# EAGLE board PT_2015_PB_MAIN_Rev2 (EAGLE 7.2.0)
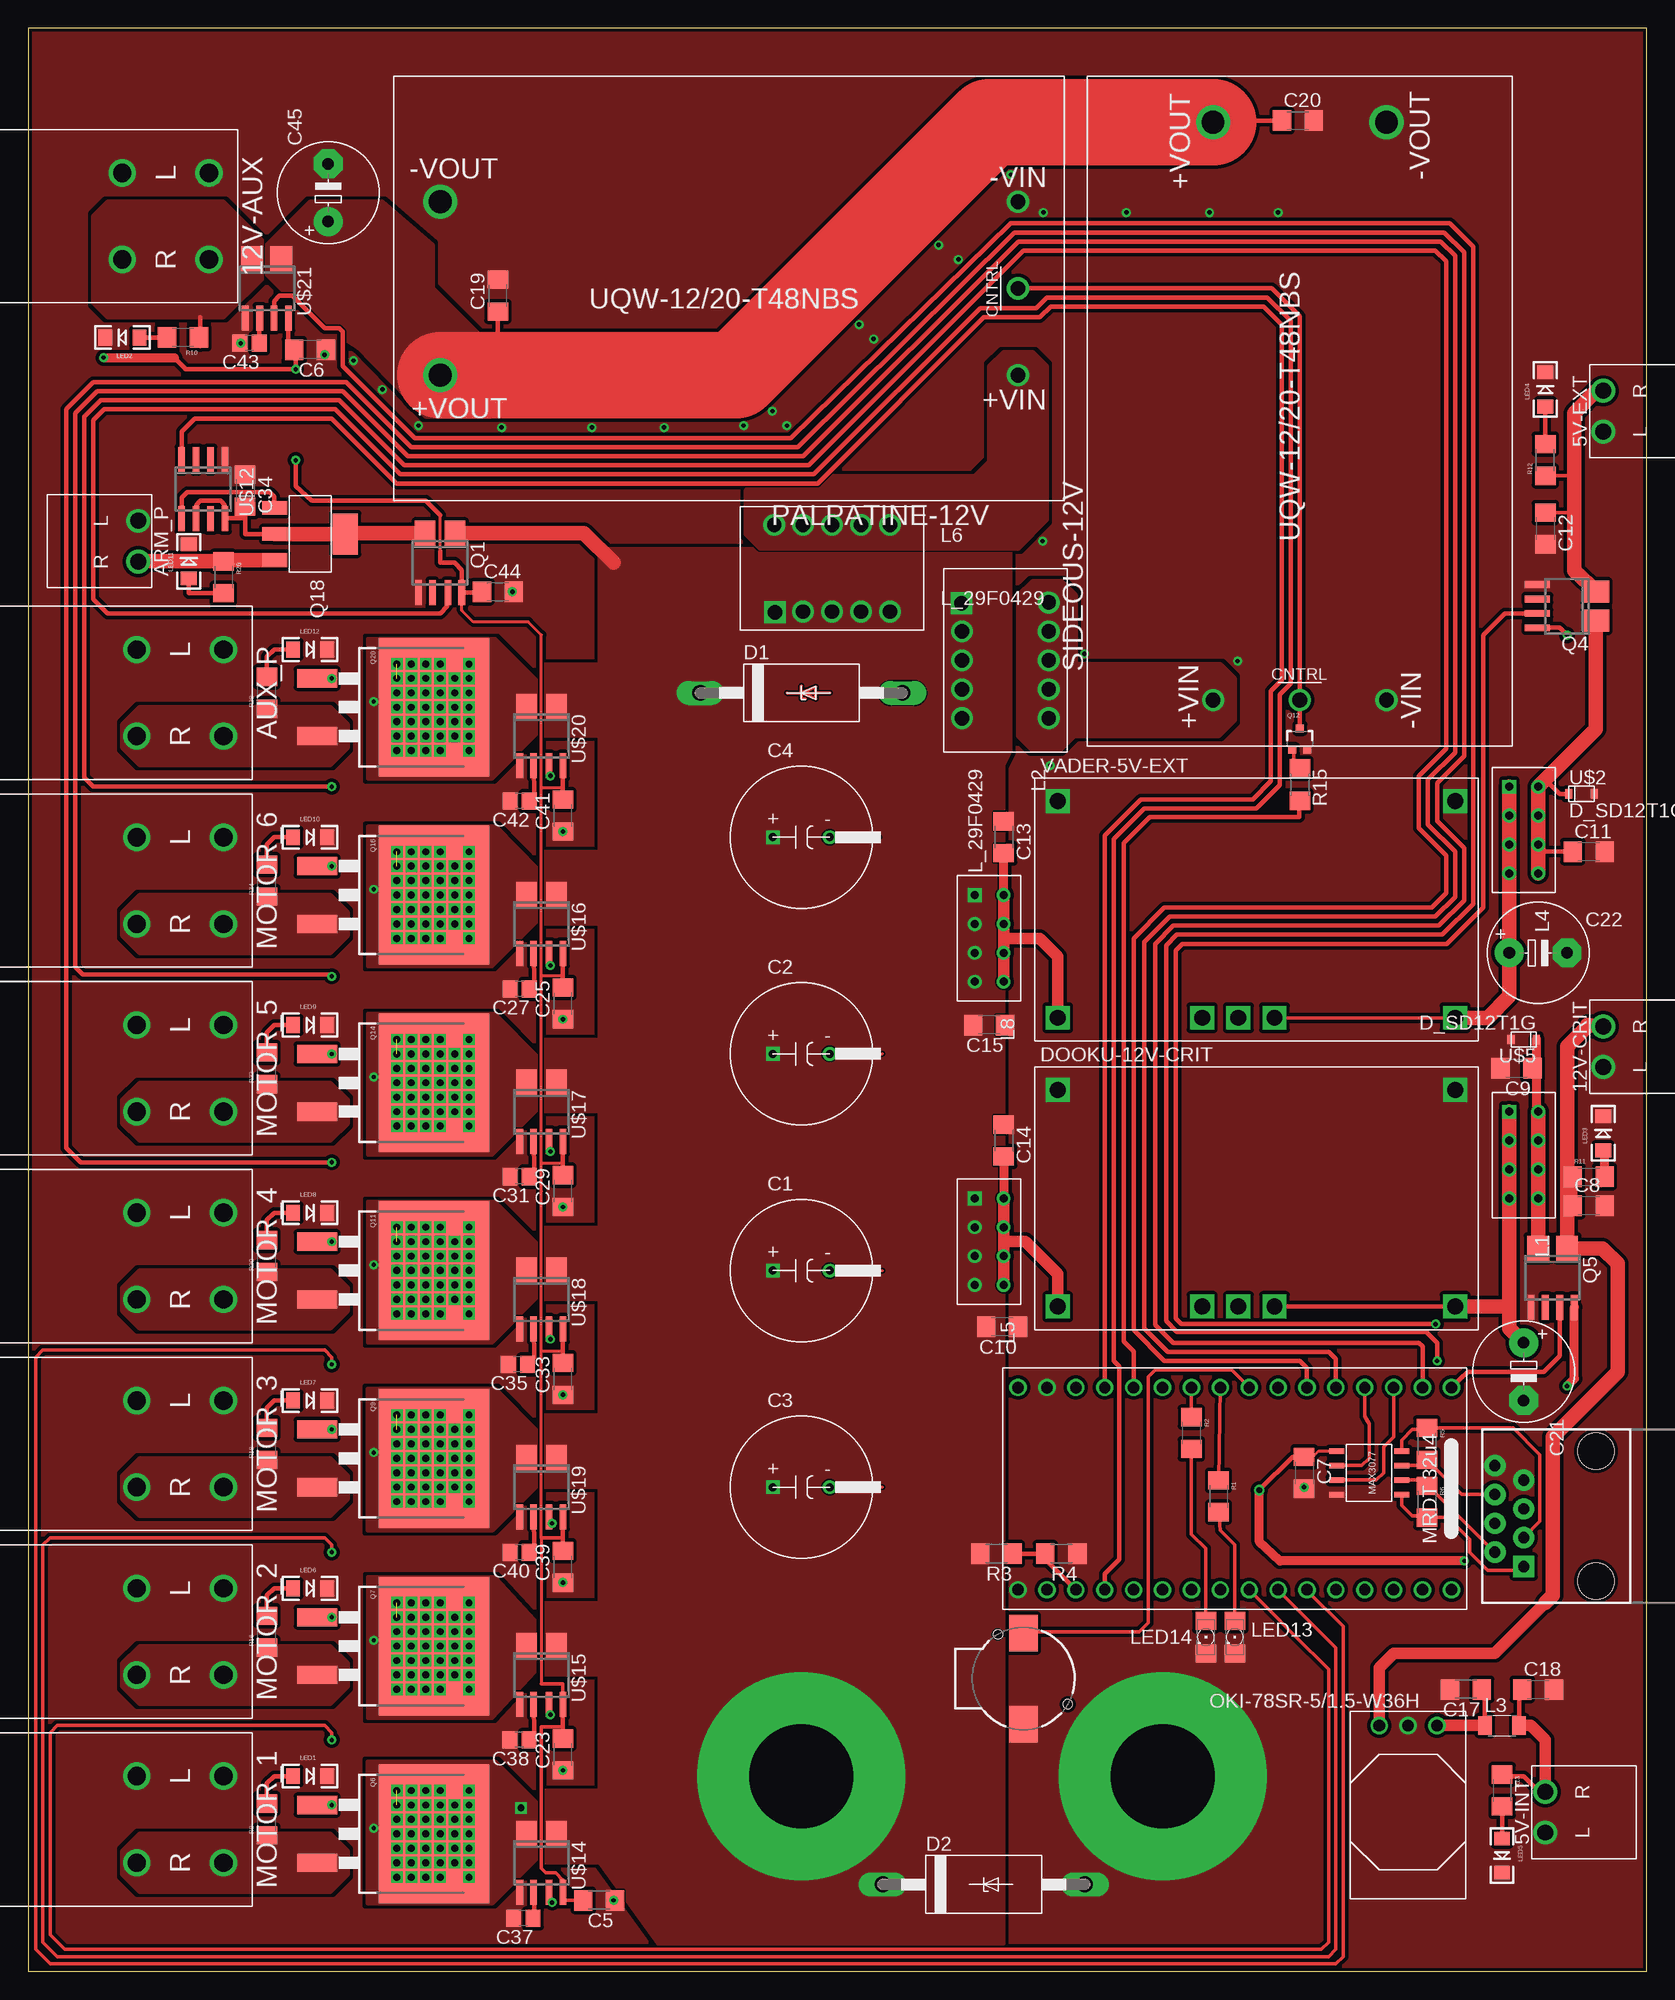
[diagram p3: board, top side]
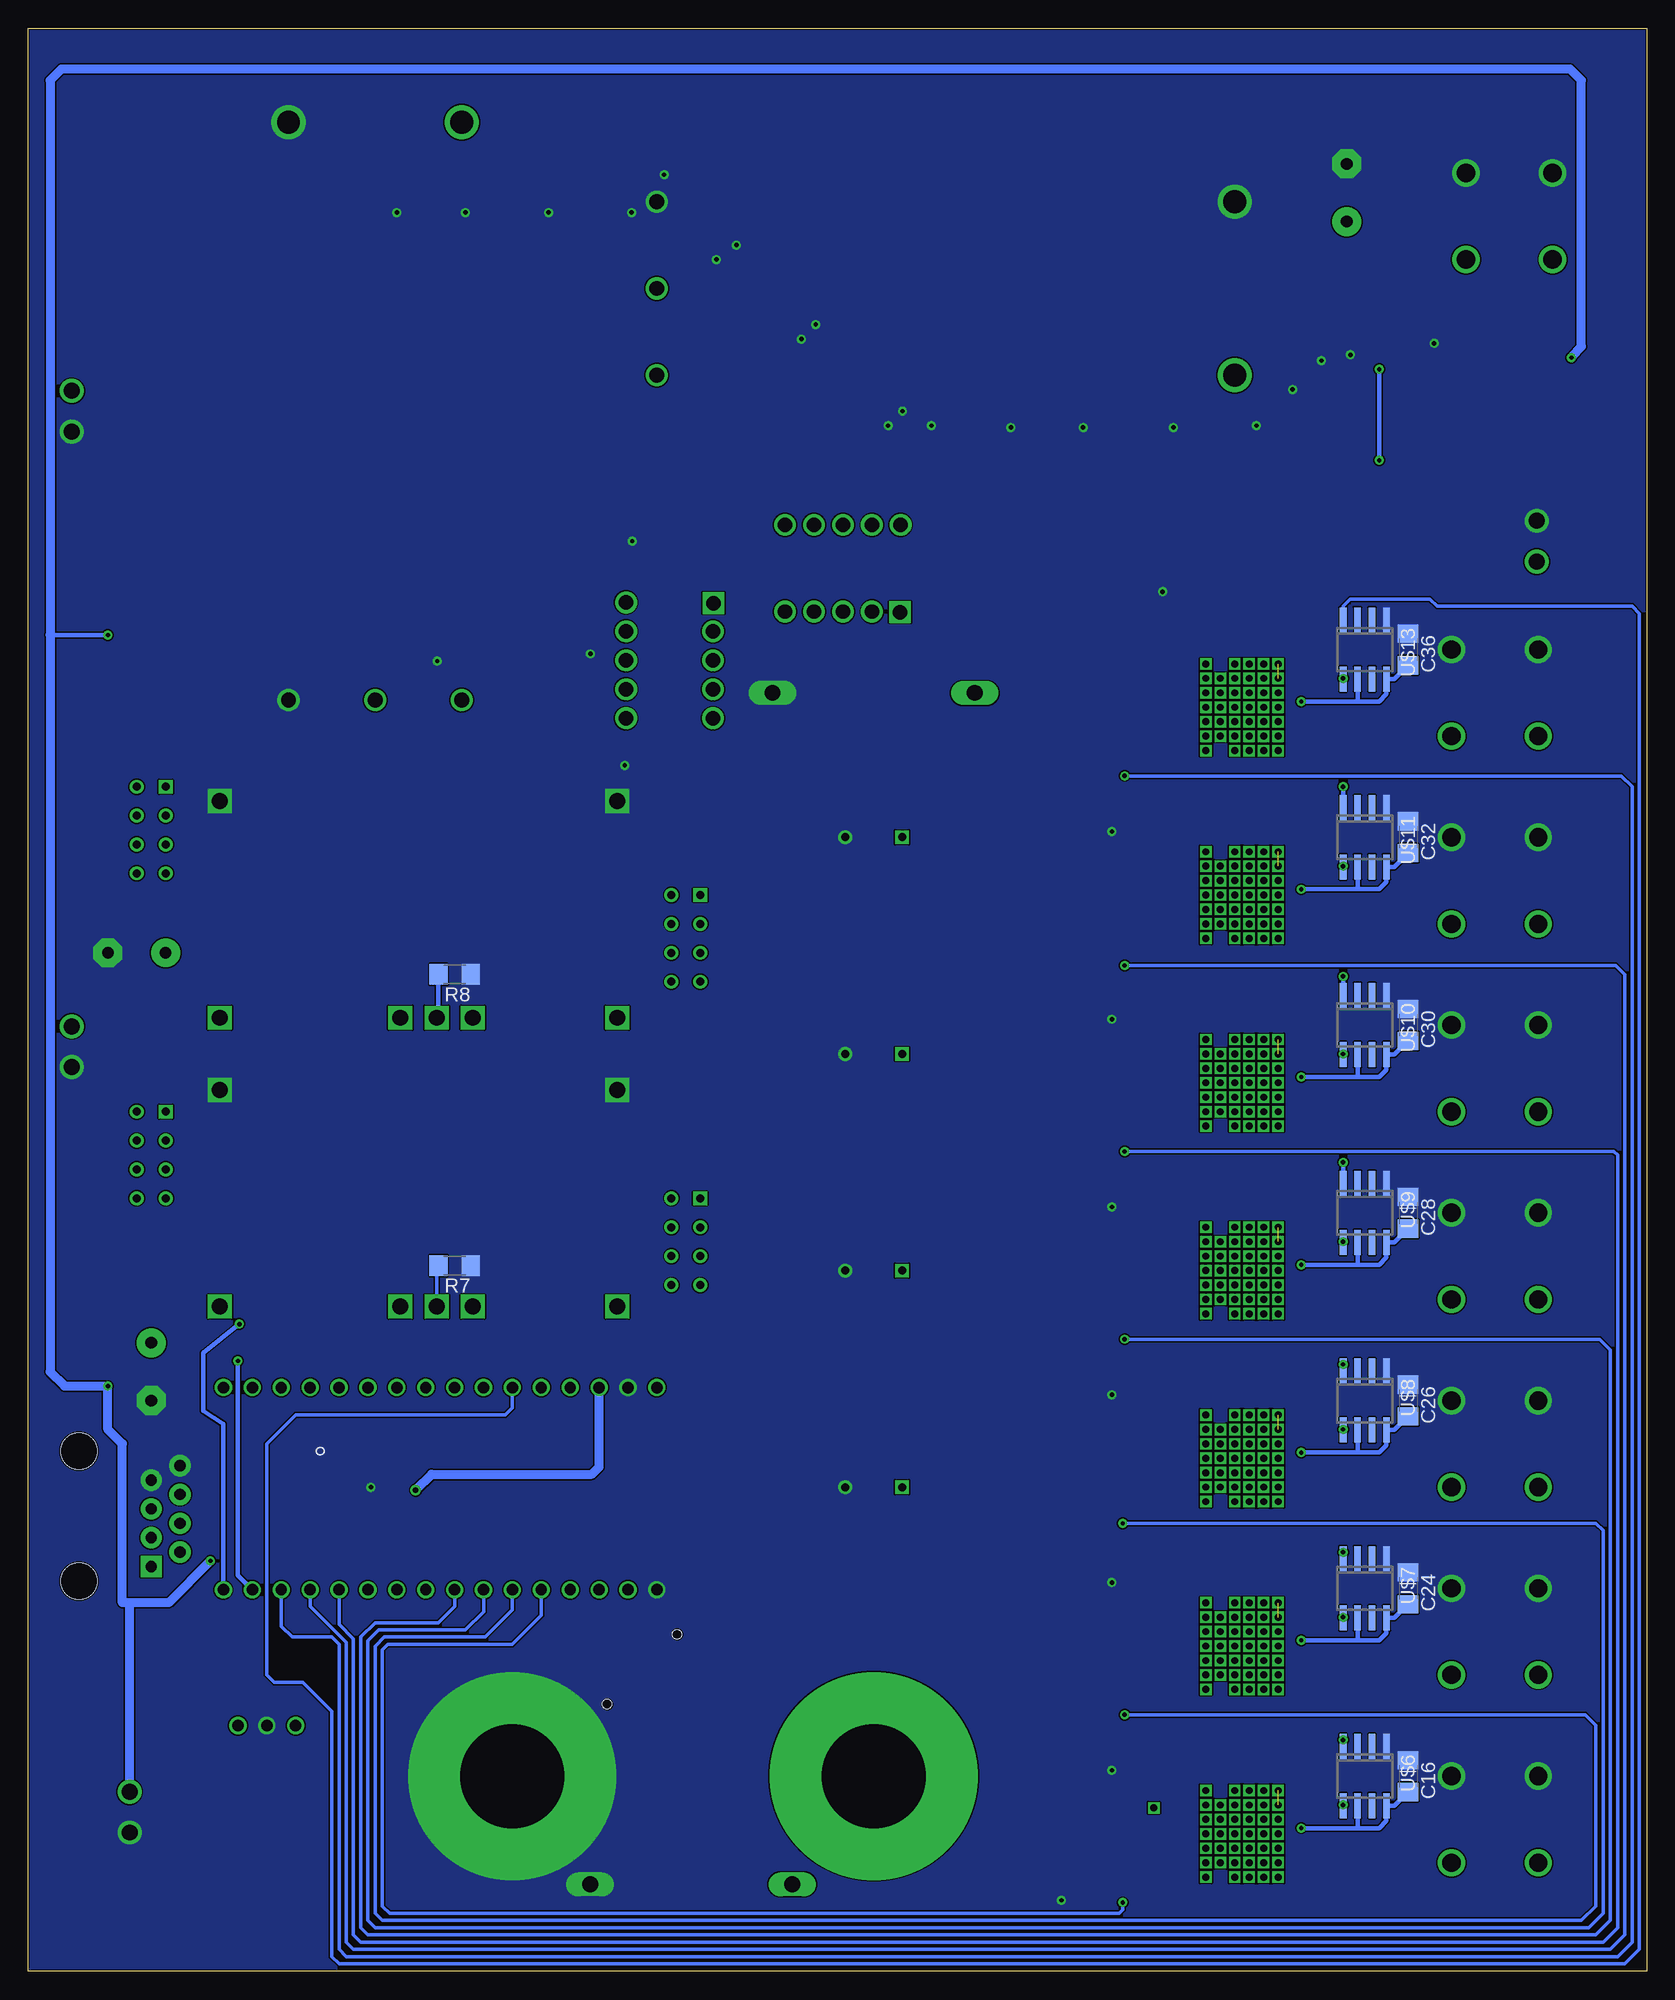
[diagram p4: board, bottom side, seen from below]

Size 142.24 x 170.81 mm. Coordinates in mm from the lower left corner, seen from the top.
Outline: 0,0 142.24,0 142.24,170.81 0,170.81 0,0
Copper layers (1*16): Top 0.035559375mm / dielectric 1.501140625mm / Bottom 0.035559375mm
Design rules "typical_4pcb *": minimum track width 5mil, minimum drill 15mil, track to track 5mil, track to pad 5mil, pad to pad 5mil, via to via 5mil, smd to smd 5mil, copper to edge 5mil, drill to drill 8mil, minimum pad ring 10mil, minimum via ring 8mil, stop-mask expansion 4mil, vias tented up to drill 0mil, thermal gap 10mil

## Footprints (pad centres in the part's own frame; a part is rotated, then mirrored left to right if it is on the bottom)
691322110002 = drill 1.4: L -1.79,0; R 1.79,0
20020618-M02 = drill 1.6: L1 -3.81,3.81; L2 -3.81,-3.81; R1 3.81,3.81; R2 3.81,-3.81
LARGE_TERMINAL_HOLE = drill 9.144 pad 18.288: P$1 0,0
C_12.5MM = drill 0.7 square: + -2.5,0 | drill 0.7: - 2.5,0
C1206 = smd 1.6 x 1.8: 1 -1.4,0; 2 1.4,0
E5-8,5 = drill 1.016 pad 2.54: + -2.54,0 | drill 1.016 pad 2.54 octagon: - 2.54,0
C0805 = smd 1.3 x 1.5: 1 -0.85,0; 2 0.85,0
CB429-17 = drill 1.397 long: A 8.89,0; C -8.89,0
R_PDSS-T7 = drill 1.4 square: 1 -17.47,9.53; 2 -17.47,-9.52; 3 -4.77,-9.52; 4 -1.59,-9.52; 5 1.59,-9.52; 6 17.47,-9.52; 7 17.47,9.53
L_29F0429 = drill 0.7 square: 1 -3.81,-1.27 | drill 0.7: 2 -1.27,-1.27; 3 1.27,-1.27; 4 3.81,-1.27; 5 3.81,1.27; 6 1.27,1.27; 7 -1.27,1.27; 8 -3.81,1.27
L_29F0528 = drill 1.27 pad 1.27 square: 1 -5.029,-7.671 | drill 1.27 pad 1.27: 2 -2.54,-7.62; 3 0,-7.62; 4 2.54,-7.62; 5 5.08,-7.62; 6 5.08,0; 7 2.54,0; 8 0,0; 9 -2.54,0; 10 -5.08,0
L3216C = smd 1.2 x 1.6: 1 -1.5,0; 2 1.5,0
LED-1206 = smd 1.2 x 1.4: A -1.5,0; C 1.5,0
FKIT-LED-1206 = smd 1.6 x 1.803: A -1.422,0; C 1.422,0
OKI-78SRH = drill 1.016: 1 2.54,0; 2 0,0; 3 -2.54,0
U-T48-QB-NO_TRIM = drill 1.3: 1 -25.4,7.62; 2 -25.4,0; 3 -25.4,-7.62 | drill 2: 4 25.4,-7.62; 8 25.4,7.62
SOIC8_ACS711_SKETCH = smd 1.8 x 2.2: 1 -1.321,-2.6; 4 1.321,-2.6 | smd 0.6 x 2.2: 5 1.905,2.6; 8 -1.905,2.6 | smd 0.55 x 2.2: 6 0.686,2.6; 7 -0.686,2.6
SOIC8_ACS711 = smd 1.92 x 2.2: 1 -1.27,-2.6; 4 1.27,-2.6 | smd 0.6 x 2.2: 5 1.905,2.6; 6 0.635,2.6; 7 -0.635,2.6; 8 -1.905,2.6
D2PACK = smd 1.6 x 3.5: 1 -2.54,-8.275; 2 2.54,-8.275 | smd 12.2 x 9.75: TAB 0,2
SOT323 = smd 0.7 x 0.7: 1 -0.65,-0.925; 2 0.65,-0.925; 3 0,0.925
SOT-223 = smd 1.2 x 2.2: 1 -2.3,-3.1; 2 0,-3.1; 3 2.3,-3.1 | smd 3.6 x 2.2: 4 0,3.1
1206 = smd 1.6 x 1.8: 1 -1.4,0; 2 1.4,0
R1206 = smd 1.6 x 1.803: 1 -1.422,0; 2 1.422,0
BUZZER-CCV = smd 3.2 x 2.5: + 4,0; - -4,0 | hole 0.8: -3.9,-2.25; 2.25,3.9
32U4_MCU_DIP = drill 1: 1 -8.89,19.05; 2 -8.89,16.51; 3 -8.89,13.97; 4 -8.89,11.43; 5 -8.89,8.89; 6 -8.89,6.35; 7 -8.89,3.81; 8 -8.89,1.27; 9 -8.89,-1.27; 10 -8.89,-3.81; 11 -8.89,-6.35; 12 -8.89,-8.89; 13 -8.89,-11.43; 14 -8.89,-13.97; 15 -8.89,-16.51; 16 -8.89,-19.05; 17 8.89,-19.05; 18 8.89,-16.51; 19 8.89,-13.97; 20 8.89,-11.43; 21 8.89,-8.89; 22 8.89,-6.35; 23 8.89,-3.81; 24 8.89,-1.27; 25 8.89,1.27; 26 8.89,3.81; 27 8.89,6.35; 28 8.89,8.89; 29 8.89,11.43; 30 8.89,13.97; 31 8.89,16.51; 32 8.89,19.05
SOD-323 = smd 0.63 x 0.83: 1 -1.115,0; 2 1.115,0
MAX3070E = smd 0.49 x 1.3: A -1.905,2.857; B -0.635,2.857; DI 0.635,-2.857; GND 1.905,-2.857; RO -0.635,-2.857; VCC -1.905,-2.857; Y 1.905,2.857; Z 0.635,2.857
RJ45-8 = drill 1 pad 1.88 square: 1 -4.445,6.35 | drill 1 pad 1.88: 2 -3.175,8.89; 3 -1.905,6.35; 4 -0.635,8.89; 5 0.635,6.35; 6 1.905,8.89; 7 3.175,6.35; 8 4.445,8.89 | hole 3.2: -5.715,0; 5.715,0
SO8 = smd 0.6 x 2.2: 1 -1.905,-2.6; 2 -0.635,-2.6; 3 0.635,-2.6; 4 1.905,-2.6; 5 1.905,2.6; 6 0.635,2.6; 7 -0.635,2.6; 8 -1.905,2.6

## Placement (x,y rotation side)
5V-EXT  H_WR-TBL_321*0002HORIZ  [691322110002]  138.43,137.16 90 top
5V-INT  H_WR-TBL_321*0002HORIZ  [691322110002]  133.35,13.97 90 top
12V-AUX  H_20020618-M02  [20020618-M02]  12.07,154.31 270 top
12V-CRIT  H_WR-TBL_321*0002HORIZ  [691322110002]  138.43,81.28 90 top
ARM_P  H_WR-TBL_321*0002HORIZ  [691322110002]  9.65,125.73 270 top
AUX_P  H_20020618-M02  [20020618-M02]  13.34,112.4 270 top
BATT-NEG  TERMINAL_HOLE  [LARGE_TERMINAL_HOLE]  99.69,17.14 0 top
BATT-POS  TERMINAL_HOLE  [LARGE_TERMINAL_HOLE]  67.94,17.14 0 top
C1  1mF  [C_12.5MM]  67.94,61.59 0 top
C2  1mF  [C_12.5MM]  67.94,80.65 0 top
C3  1mF  [C_12.5MM]  67.94,42.55 0 top
C4  1mF  [C_12.5MM]  67.94,99.69 0 top
C5  .1µF  [C1206]  50.16,6.22 180 top
C6  .1µF  [C1206]  24.77,142.56 180 top
C7  1uF  [C1206]  112.14,43.81 270 top
C8  10µf  [C1206]  137.16,67.31 0 top
C9  [C1206]  130.81,79.38 180 top
C10  2.2µF  [C1206]  85.6,56.64 180 top
C11  [C1206]  137.16,98.43 0 top
C12  47µf  [C1206]  133.35,126.84 270 top
C13  2.2µF  [C1206]  85.72,99.69 270 top
C14  2.2µF  [C1206]  85.72,73.03 270 top
C15  2.2µF  [C1206]  84.46,83.19 180 top
C16  10µF  [C1206]  20.96,17.14 270 bottom
C17  47µF  [C1206]  126.37,24.77 180 top
C18  47µF  [C1206]  132.72,24.77 0 top
C19  [C1206]  41.27,147.32 90 top
C20  [C1206]  111.6,162.72 0 top
C21  330µF  [E5-8,5]  131.44,52.7 270 top
C22  330µF  [E5-8,5]  132.72,89.53 0 top
C23  .1µF  [C1206]  46.99,19.05 90 top
C24  10µF  [C1206]  20.96,33.66 270 bottom
C25  .1µF  [C1206]  46.99,85.09 90 top
C26  10µF  [C1206]  20.96,50.16 270 bottom
C27  1nF  [C0805]  43.18,86.36 180 top
C28  10µF  [C1206]  20.96,66.67 270 bottom
C29  .1µF  [C1206]  46.99,68.58 90 top
C30  10µF  [C1206]  20.96,83.19 270 bottom
C31  1nF  [C0805]  43.18,69.85 180 top
C32  10µF  [C1206]  20.96,99.69 270 bottom
C33  .1µF  [C1206]  46.99,52.07 90 top
C34  10µF  [C1206]  19.05,130.18 270 top
C35  1nF  [C0805]  43.02,53.34 180 top
C36  10µF  [C1206]  20.96,116.21 270 bottom
C37  1nF  [C0805]  43.5,4.64 180 top
C38  1nF  [C0805]  43.15,20.32 180 top
C39  .1µF  [C1206]  46.99,35.56 90 top
C40  1nF  [C0805]  43.18,36.83 180 top
C41  .1µF  [C1206]  46.99,101.6 90 top
C42  1nF  [C0805]  43.18,102.87 180 top
C43  1nF  [C0805]  19.43,143.13 180 top
C44  .1µF  [C1206]  41.27,121.28 0 top
C45  330µF  [E5-8,5]  26.35,156.37 90 top
D1  1.5KE36A  [CB429-17]  67.94,112.4 0 top
D2  1.5KE36A  [CB429-17]  83.98,7.62 0 top
DOOKU-12V-CRIT  Q_PTN78020WAH  [R_PDSS-T7]  107.95,67.94 0 top
L1  L_29F0429  [L_29F0429]  131.44,71.75 270 top
L2  L_29F0429  [L_29F0528]  89.69,115.25 270 top
L3  [L3216C]  129.54,21.59 0 top
L4  L_29F0429  [L_29F0429]  131.44,100.33 270 top
L5  L_29F0429  [L_29F0429]  84.46,64.13 270 top
L6  L_29F0429  [L_29F0528]  70.64,127.16 0 top
L8  L_29F0429  [L_29F0429]  84.46,90.81 270 top
LED1  [LED-1206]  24.77,17.14 0 top
LED2  [LED-1206]  8.26,143.64 180 top
LED3  [LED-1206]  138.43,73.66 90 top
LED4  [LED-1206]  133.35,139.06 90 top
LED5  [LED-1206]  129.54,10.16 270 top
LED6  [LED-1206]  24.77,33.66 0 top
LED7  [LED-1206]  24.77,50.16 0 top
LED8  [LED-1206]  24.77,66.67 0 top
LED9  [LED-1206]  24.77,83.19 0 top
LED10  [LED-1206]  24.77,99.69 0 top
LED11  [LED-1206]  14.1,123.95 90 top
LED12  [LED-1206]  24.77,116.21 0 top
LED13  [FKIT-LED-1206]  106.04,29.37 270 top
LED14  [FKIT-LED-1206]  103.5,29.37 270 top
MOTOR_1  H_20020618-M02  [20020618-M02]  13.34,13.34 270 top
MOTOR_2  H_20020618-M02  [20020618-M02]  13.34,29.84 270 top
MOTOR_3  H_20020618-M02  [20020618-M02]  13.34,46.35 270 top
MOTOR_4  H_20020618-M02  [20020618-M02]  13.34,62.87 270 top
MOTOR_5  H_20020618-M02  [20020618-M02]  13.34,79.38 270 top
MOTOR_6  H_20020618-M02  [20020618-M02]  13.34,95.88 270 top
OKI-78SR-5/1.5-W36H  Q_OKI-78SR  [OKI-78SRH]  121.28,21.59 180 top
PALPATINE-12V  UQW-12/20-T48NBS  [U-T48-QB-NO_TRIM]  61.59,147.95 180 top
Q1  Q_ACS711LC_SKETCH  [SOIC8_ACS711_SKETCH]  36.2,123.82 180 top
Q4  Q_ACS711LC  [SOIC8_ACS711]  135.25,120.01 90 top
Q5  Q_ACS711LC  [SOIC8_ACS711]  133.98,60.96 180 top
Q6  Q_IRFS7437PbF  [D2PACK]  33.66,12.07 270 top
Q7  Q_IRFS7437PbF  [D2PACK]  33.66,28.57 270 top
Q9  Q_IRFS7437PbF  [D2PACK]  33.66,45.09 270 top
Q11  Q_IRFS7437PbF  [D2PACK]  33.66,61.59 270 top
Q12  2N7002  [SOT323]  111.76,108.33 0 top
Q14  Q_IRFS7437PbF  [D2PACK]  33.66,78.1 270 top
Q16  Q_IRFS7437PbF  [D2PACK]  33.66,94.62 270 top
Q18  Q_FDT86102LZ  [SOT-223]  24.77,126.37 270 top
Q20  Q_IRFS7437PbF  [D2PACK]  33.66,111.12 270 top
R1  1k Ohm  [1206]  104.62,41.75 270 top
R2  1k Ohm  [1206]  102.24,47.31 270 top
R3  60kΩ  [R1206]  85.09,36.7 180 top
R4  10kΩ  [R1206]  90.81,36.7 180 top
R5  120 Ohm  [1206]  122.94,46.35 270 top
R6  120 Ohm  [1206]  122.94,41.27 270 top
R7  590Ω  [R1206]  104.78,62.04 180 bottom
R8  21kΩ  [R1206]  104.78,87.63 180 bottom
R9  1kΩ  [1206]  20.96,13.34 90 top
R10  1kΩ  [1206]  13.59,143.64 180 top
R11  1kΩ  [1206]  137.16,69.85 0 top
R12  1kΩ  [1206]  133.35,132.87 90 top
R13  1kΩ  [1206]  129.54,15.88 270 top
R15  [R1206]  111.76,104.33 270 top
R16  1kΩ  [1206]  20.96,29.84 90 top
R18  1kΩ  [1206]  20.96,46.35 90 top
R20  1kΩ  [1206]  20.96,62.87 90 top
R22  1kΩ  [1206]  20.96,79.38 90 top
R24  1kΩ  [1206]  20.96,95.88 90 top
R26  1kΩ  [1206]  17.14,122.56 270 top
R28  1kΩ  [1206]  20.96,112.4 90 top
SG1  BUZZERSMD2  [BUZZER-CCV]  87.47,25.72 270 top
SIDEOUS-12V  UQW-12/20-T48NBS  [U-T48-QB-NO_TRIM]  111.76,137.16 90 top
U$1  32U4_BREAKOUT  [32U4_MCU_DIP]  106.04,42.42 270 top
U$2  D_SD12T1G  [SOD-323]  136.53,103.5 0 top
U$3  MAX3077  [MAX3070E]  117.86,43.81 270 top
U$4  RJ45-8PTH  [RJ45-8]  137.79,40.01 90 top
U$5  D_SD12T1G  [SOD-323]  131.44,81.91 180 top
U$6  LT1910  [SO8]  24.77,17.14 180 bottom
U$7  LT1910  [SO8]  24.77,33.66 180 bottom
U$8  LT1910  [SO8]  24.77,50.16 180 bottom
U$9  LT1910  [SO8]  24.77,66.67 180 bottom
U$10  LT1910  [SO8]  24.77,83.19 180 bottom
U$11  LT1910  [SO8]  24.77,99.69 180 bottom
U$12  LT1910  [SO8]  15.37,130.3 180 top
U$13  LT1910  [SO8]  24.77,116.21 180 bottom
U$14  ACS714LLCTR-50A-T  [SOIC8_ACS711_SKETCH]  45.09,9.53 180 top
U$15  ACS714LLCTR-50A-T  [SOIC8_ACS711_SKETCH]  45.09,26.04 180 top
U$16  ACS714LLCTR-50A-T  [SOIC8_ACS711_SKETCH]  45.09,92.07 180 top
U$17  ACS714LLCTR-50A-T  [SOIC8_ACS711_SKETCH]  45.09,75.56 180 top
U$18  ACS714LLCTR-50A-T  [SOIC8_ACS711_SKETCH]  45.09,59.05 180 top
U$19  ACS714LLCTR-50A-T  [SOIC8_ACS711_SKETCH]  45.09,42.55 180 top
U$20  ACS714LLCTR-50A-T  [SOIC8_ACS711_SKETCH]  45.09,108.59 180 top
U$21  ACS714LLCTR-50A-T  [SOIC8_ACS711]  20.96,147.95 180 top
VADER-5V-EXT  Q_PTN78020WAH  [R_PDSS-T7]  107.95,93.34 0 top

## Tracks (layer width: path | path; a pad name or v marks a point on that pad's centre or on a via)
5V-EXT
  Top 0.305: C12.1 135.86,128.24 135.89,128.27 | R12.1 135.38,131.47 135.89,130.97
  Top 1.27: 137.91,138.95 5V-EXT.R 137.84,138.95 135.89,137 135.89,130.97 135.89,128.27 135.89,123.13 Q4.4
5V-IMEAS  (via drill 0.38)
  Top 0.406: v123.7,56.9 101.35,56.9 100.87,57.37 100.87,89.76 101.41,90.3 124.68,90.3 127.89,93.5 127.89,117.47 129.79,119.38 Q4.7
  Bottom 0.406: U$1.32 125.09,48.13 126.87,49.28 126.87,54.36 v123.7,56.9
12V-AUX
  Top 0.406: R10.1 15.11,142.88 15.11,145.41
  pour Top (rank 2, no thermals): 20.96,151.76 20.96,149.22 17.14,145.41 6.99,145.41 5.71,146.69 5.71,154.31 6.99,155.57 17.14,155.57
12V-CRIT
  Top 0.406: C8.1 135.25,73.66
  Top 0.813: R11.1 135.76,67.81 135.25,67.31
  Top 1.016: OKI-78SR-5/1.5-W36H.1 118.75,26.67 120.01,27.94 128.91,27.94 133.35,32.39
  Top 1.27: 12V-CRIT.R 137.04,83.19 137.16,83.19 135.25,81.28 135.25,73.66 135.25,67.31 Q5.1 138.37,63.56 139.7,62.23 139.7,52.7 133.98,46.99 133.98,33.02 133.35,32.39
12V-IMEAS  (via drill 0.38)
  Top 0.406: v123.82,53.66 123.82,55.24 122.87,56.2 100.97,56.2 100.01,57.15 100.01,90.17 100.97,91.12 124.3,91.12 127,93.82 127,151.61 124.94,153.67 86.36,153.67 66.99,134.78 33.97,134.78 27.62,141.13 27.62,144.14 27.3,144.46 26.04,144.46 23.18,147.32 22.07,147.32 21.59,146.84 U$21.7
  Bottom 0.406: U$1.31 123.82,34.8 v123.82,53.66
12V-SIG
  Top 0.406: R15.2 111.74,103.2 111.74,101.47 98.55,101.47 96.27,99.19 96.27,55.37 97.16,54.48 U$1.12
+5V  (via drill 0.38, 0.5)
  Top 0.254: 45.09,54.48 45.09,38.1 45.09,25.24 | 45.09,54.48 45.09,68.58 | 45.09,87.5 45.09,70.99 46.99,70.99 | 45.09,87.5 45.09,104.01 | 45.09,104.01 45.09,117.47 43.94,118.62 39.12,118.62 38.1,119.63 38.1,120.52 | 46.99,54.48 45.09,54.48 | 46.99,87.5 45.09,87.5 | 46.99,104.01 45.09,104.01 | 36.2,124.84 36.2,128.02
  Top 0.279: C7.1 112.91,45.22 113.41,45.72 U$3.VCC | 45.09,68.58 45.09,70.99
  Top 0.305: 46.99,6.22 C5.2 | U$19.8 46.99,38.1 45.09,38.1 | C33.2 46.99,54.48 | C29.2 46.99,70.99 | C25.2 46.99,87.5 | U$20.8 46.99,104.01 | C23.2 46.99,21.46 45.09,21.46 45.09,9.02 45.47,8.64 46.35,8.64 46.99,8 | 38.1,120.52 Q1.8 38.1,122.05 | 23.5,142.11 C6.2 | 45.09,25.24 46.99,25.24 U$15.8
  Top 0.406: C23.2 U$15.8 | U$19.8 C39.2 | U$18.8 C33.2 | U$17.8 C29.2 | U$16.8 C25.2 | U$20.8 C41.2 | U$21.8 22.86,142.75 C6.2 | Q1.8 39.81,121.22 C44.1 | L3.2 131.04,24.49 C18.1 | 5V-INT.R 132.83,15.76 131.44,17.14 129.67,17.14 R13.1 | C7.1 111.13,45.22 v108.2,42.29 | Q4.8 134.62,118.11 v135.25,117.47 | 36.2,128.02 34.92,129.29 24.89,129.29 23.5,130.56 v23.5,132.84 | 23.5,142.11 v23.5,140.84 13.84,140.84 | 13.78,140.84 13.84,140.84 | 38.1,122.05 38.1,123.19 37.47,123.82 36.2,123.82 36.2,124.84 | 46.99,8 U$14.8 46.99,6.22 46.99,6.1 | 12.83,141.86 13.84,140.84
  Top 0.813: v126.24,36.07 110.01,36.07 108.2,37.75 v108.2,42.29 | v135.25,51.44 135.89,52.07 Q5.8 | v6.6,141.86 12.83,141.86
  Top 1.016: L3.2 132.08,21.59 133.35,20.32 5V-INT.R
  Bottom 0.406: 133.35,15.88 5V-INT.R | v23.5,132.84 v23.5,140.84 | v135.25,117.47 140.33,117.47
  Bottom 0.813: 133.35,15.88 133.35,32.39 | v108.2,42.29 106.81,43.69 92.71,43.69 92.07,44.32 U$1.14 | v126.24,36.07 129.92,32.39 133.35,32.39 | 133.35,32.39 133.98,32.39 133.98,46.35 135.25,47.62 v135.25,51.44 139.06,51.44 140.33,52.7 140.33,117.47 140.33,166.24 139.32,167.26 6.73,167.26 5.71,166.24 5.71,142.88 v6.6,141.86
ARM_P-IMEAS
  Top 0.406: Q1.7 36.83,120.01 36.2,119.38 6.99,119.38 5.71,120.65 5.71,136.37 6.67,137.32 26.99,137.32 32.7,131.6 69.06,131.6 83.66,146.21 88.58,146.21 89.53,147.16 108.9,147.16 110.97,145.1 110.97,113.19 110.01,112.24 110.01,104.3 107.95,102.24 98.11,102.24 95.41,99.54 95.41,53.66 95.88,53.18 95.88,36.2 94.62,34.92 U$1.20
ARM_P-SIG
  Top 0.406: U$12.4 13.46,135.38 14.61,136.53 26.67,136.53 32.39,130.81 69.37,130.81 83.98,145.41 88.9,145.41 89.85,146.37 108.59,146.37 110.17,144.78 110.17,113.51 109.22,112.55 109.22,104.62 107.63,103.03 97.79,103.03 94.62,99.85 U$1.13
AUX_P-IMEAS  (via drill 0.38)
  Top 0.305: U$20.7 45.88,105.83 v45.88,105.09
  Bottom 0.305: v45.88,105.09 2.22,105.09 1.27,104.14 1.27,2.54 2.54,1.27 114.3,1.27 114.94,1.91 114.94,28.73 115.57,29.37 119.06,29.37 120.01,30.32 U$1.30
AUX_P-SIG
  Bottom 0.305: U$13.4 26.67,120.01 26.04,120.65 19.05,120.65 18.41,120.01 1.27,120.01 0.64,119.38 0.64,1.91 1.91,0.64 114.94,0.64 115.57,1.27 115.57,22.86 118.11,25.4 120.65,25.4 121.28,26.04 121.28,46.35 118.75,48.9 100.33,48.9 99.69,49.53 U$1.11
BUZZ_BUZZ_MOTHERFUCKER
  Top 0.305: SG1.- 87.6,29.84 97.63,29.84 98.43,30.64 98.43,35.56 98.43,38.58 98.43,52.23 99.06,52.86 105.76,52.86 U$1.8
CRIT-IMEAS
  Top 0.406: U$1.1 126.52,52.7 133.22,52.7 134.62,54.1 Q5.7
GND  (via drill 0.38)
  Top 0.406: v51.44,6.22 C5.1
  other vias: 46.99,17.65 46.99,34.16 46.99,50.67 46.99,67.18 46.99,83.69 46.99,100.2 42.55,121.28 112.14,42.55 26.04,142.11 18.67,143.13 106.3,115.19 89.82,106.01 92.84,115.82 89.15,125.73 28.57,141.6 31.12,139.06 34.29,135.89 41.59,135.73 49.53,135.73 55.88,135.73 62.87,135.89 65.41,137.16 66.67,135.89 73.03,144.78 74.29,143.51 81.76,150.5 80.01,151.76 89.22,154.62 86.36,157.96 96.52,154.62 103.82,154.62 109.85,154.62
  pour Bottom (no thermals): -0.63,-1.9 158.11,-1.9 158.11,175.89 -0.63,175.89
  pour Top (isolate 0.305, rank 4, no thermals): -0.63,177.8 149.86,177.8 149.86,-6.98 -0.63,-6.98
INFO_LED_1
  Top 0.305: U$1.9 R1.1
INFO_LED_2
  Top 0.305: U$1.10 R2.1
M1-IMEAS  (via drill 0.38)
  Top 0.305: 45.72,6.35 v46.04,6.03
  Top 0.406: U$14.7 45.72,6.35
  Bottom 0.305: v46.04,6.03 46.04,5.4 46.35,5.08 110.49,5.08 111.12,5.71 111.12,28.26 110.65,28.73 99.69,28.73 97.16,31.27 U$1.21
M1-SIG  (via drill 0.38)
  Top 0.305: v26.67,20.32 26.67,20.96 26.04,21.59 2.54,21.59 1.91,20.96 1.91,3.18 3.18,1.91 113.66,1.91 114.3,2.54 114.3,26.51 111.28,29.53 108.9,31.94 U$1.25
  Bottom 0.305: U$6.4 v26.67,20.32
M2-IMEAS  (via drill 0.38)
  Top 0.406: U$15.7 45.72,22.7 v45.88,22.54
  Bottom 0.305: v45.88,22.54 5.4,22.54 4.45,21.59 4.45,5.71 5.71,4.45 111.12,4.45 111.76,5.08 111.76,28.57 110.97,29.37 102.08,29.37 99.69,31.75 U$1.22
M2-SIG  (via drill 0.38)
  Top 0.305: v26.67,36.83 26.67,37.47 26.04,38.1 1.91,38.1 1.27,37.47 1.27,2.54 2.54,1.27 114.3,1.27 114.94,1.91 114.94,28.42 109.85,33.5 U$1.26
  Bottom 0.305: U$7.4 v26.67,36.83
M3-IMEAS  (via drill 0.38)
  Top 0.305: v46.04,39.37 46.04,39.63 U$19.7
  Bottom 0.305: v46.04,39.37 4.45,39.37 3.81,38.73 3.81,5.08 5.08,3.81 111.76,3.81 112.4,4.45 112.4,29.05 111.44,30 103.82,30 102.24,31.59 U$1.23
M3-SIG  (via drill 0.38)
  Top 0.305: v26.67,53.34 26.67,53.98 26.04,54.61 1.27,54.61 0.64,53.98 0.64,1.91 1.91,0.64 114.94,0.64 115.57,1.27 115.57,30.32 112.4,33.5 U$1.27
  Bottom 0.305: U$8.4 v26.67,53.34
M4-IMEAS  (via drill 0.38)
  Top 0.305: U$18.7 45.88,56.3 v45.88,55.56
  Bottom 0.305: v45.88,55.56 4.13,55.56 3.18,54.61 3.18,4.45 4.45,3.18 112.4,3.18 113.03,3.81 113.03,29.37 111.76,30.64 106.2,30.64 104.78,32.07 U$1.24
M4-SIG  (via drill 0.38)
  Top 0.406: v26.67,71.12 4.6,71.12 3.33,72.39 3.33,137.32 5.71,139.7 27.94,139.7 33.66,133.98 67.63,133.98 86.68,152.88 124.46,152.88 126.21,151.13 126.21,106.84 123.82,104.46 123.82,101.12 126.21,98.74 126.21,94.14 123.98,91.92 100.65,91.92 99.06,90.33 99.06,56.83 100.65,55.24 122.24,55.24 122.56,54.93 U$1.2
  Bottom 0.406: v26.67,71.12 U$9.4
M5-IMEAS  (via drill 0.38)
  Top 0.305: v45.88,72.07 45.88,72.81 U$17.7
  Bottom 0.305: v45.88,72.07 2.86,72.07 2.54,71.75 2.54,3.81 3.81,2.54 113.03,2.54 113.66,3.18 113.66,29.21 114.94,30.48 U$1.28
M5-SIG  (via drill 0.38)
  Top 0.406: v26.67,87.47 26.51,87.63 4.76,87.63 4.13,88.26 4.13,137 6.03,138.91 27.62,138.91 33.34,133.19 68.1,133.19 87,152.08 124.14,152.08 125.41,150.81 125.41,107.16 123.03,104.78 123.03,100.81 125.41,98.43 125.41,94.46 123.67,92.71 100.33,92.71 98.11,90.49 98.11,56.52 100.17,54.45 114.3,54.45 114.94,53.82 U$1.5
  Bottom 0.406: U$10.4 v26.67,87.47
M6-IMEAS  (via drill 0.38)
  Top 0.305: 45.88,88.58 U$16.7 45.88,89.32 v45.88,88.42
  Bottom 0.305: v45.88,88.42 2.7,88.42 1.91,87.63 1.91,3.18 3.18,1.91 113.66,1.91 114.3,2.54 114.3,28.89 117.47,32.07 U$1.29
M6-SIG  (via drill 0.38)
  Top 0.406: v26.67,104.14 5.71,104.14 4.92,104.93 4.92,136.68 6.35,138.11 27.3,138.11 33.02,132.4 68.58,132.4 87.47,151.29 123.67,151.29 124.62,150.34 124.62,107.47 122.24,105.09 122.24,100.49 124.62,98.11 124.62,94.77 123.35,93.5 99.85,93.5 97.16,90.81 97.16,56.36 99.85,53.66 111.76,53.66 112.4,53.02 U$1.6
  Bottom 0.406: U$11.4 v26.67,104.14
N$1
  Top 0.406: U$14.6 44.45,5.2 C37.1
N$2
  Top 0.406: U$15.6 44.45,20.82 C38.1
N$3
  Top 0.813: L8.8 C13.2
  Top 1.016: L8.8 L8.7 85.72,90.81 | L8.5 L8.6 85.72,90.81 | VADER-5V-EXT.2 90.48,89.22 88.9,90.81 85.72,90.81
N$4
  Top 0.406: Q12.3 SIDEOUS-12V.2 111.76,145.51 109.31,147.95 PALPATINE-12V.2
N$5
  pour Top (no thermals): 64.33,125.09 87,125.09 89.53,127.63 89.53,141.1 88.26,142.37 85.72,142.37 84.46,141.1 84.46,132.72 83.19,131.44 64.33,131.44 63.06,130.18 63.06,126.37
N$6
  pour Top (no thermals): 88.26,122.24 87,120.97 87,108.59 88.26,107.31 90.65,107.31 91.92,108.59 104.65,108.59 106.04,109.98 106.04,113.66 104.78,114.94 92.07,114.94 92.07,120.97 90.81,122.24
N$7
  Top 0.406: C20.1 104.14,162.72 SIDEOUS-12V.8 | C19.1 41.27,142.88 40.8,142.88 40.8,142.24 41.59,142.24 41.59,141.92 41.91,141.92 41.91,140.33
  Top 7.62: PALPATINE-12V.8 41.91,140.33 62.23,140.33 84.46,162.56 SIDEOUS-12V.8
  pour Top: 31.12,155.57 28.89,155.57 28.89,142.88 34.92,136.68 40.64,136.68 40.64,142.88 35.56,147.95 35.56,151.76
  pour Top (no thermals): 29.05,155.57 29.05,142.72 24.77,145.41 20.96,149.22 20.96,151.76 24.77,155.57
N$8
  Top 0.813: C14.2 L5.8
  Top 1.016: L5.8 L5.7 85.72,64.13 | 85.72,64.13 L5.6 L5.5 | DOOKU-12V-CRIT.2 90.48,61.29 87.63,64.13 85.72,64.13
N$9
  Bottom 0.305: DOOKU-12V-CRIT.4 106.36,61.88 R7.2
N$10
  Top 0.813: L1.8 132.56,75.72 U$5.1 132.56,79.72 C9.1
  Top 1.27: L1.8 L1.7 L1.6 L1.5 Q5.4
N$11
  Top 0.305: LED13.A 106.04,37.47 104.78,38.73 R1.2
N$12
  Top 0.406: U$21.6 C43.1
N$14
  Top 0.305: U$3.Y 120.71,40.96 121.67,40.01 122.81,40.01 R6.2 124.75,39.88 126.68,37.94 126.68,36.83 128.27,35.24 131.13,35.24 U$4.1
N$15
  Top 0.305: VADER-5V-EXT.6 VADER-5V-EXT.5
  Top 1.27: VADER-5V-EXT.6 128.28,83.82 130.18,85.72 C22.+ L4.4 L4.3 L4.2 L4.1
N$16
  Top 0.406: U$2.1 134.62,103.5 133.35,104.78 | C11.1 133.35,98.43 L4.6
  Top 1.27: L4.5 L4.6 L4.7 L4.8 133.35,104.78 137.79,109.22 137.79,118.69 Q4.1
N$17
  Top 0.406: U$16.6 44.45,86.87 C27.1
N$18
  Top 0.305: U$3.Z 122.43,43.18 R6.1 123.06,42.67 U$4.2
N$19
  Top 0.305: U$3.B 122.43,44.45 R5.2 125.98,41.91 U$4.6
N$20
  Top 0.305: U$3.A 120.71,46.67 121.67,47.62 122.81,47.62 R5.1 130.52,47.76 132.87,45.4 132.87,39.53 U$4.3
N$21
  Top 0.305: U$3.DI 118.49,43.18 119.13,43.81 119.13,46.1 120.01,46.99 U$1.3
N$22
  Top 0.406: U$17.6 44.45,70.35 C31.1
N$23
  Top 0.406: C35.1 44.45,53.98 U$18.6
N$24
  Top 0.406: U$19.6 44.45,37.34 C40.1
N$25
  Top 0.406: U$20.6 44.45,103.38 C42.1
N$28  (via drill 0.38)
  Bottom 0.406: v30.35,29.08 25.4,29.08 | 25.4,29.08 23.5,29.08 22.86,29.72 U$7.8 22.16,31.05 C24.2 | U$7.6 25.4,29.08
  pour Top (rank 2, no thermals): 29.84,34.67 41.02,34.67 44.51,30.86 44.51,26.29 40.77,22.23 29.84,22.23
N$29
  pour Top (no thermals): 8.26,25.02 8.26,27.05 9.78,28.57 26.54,28.57 28.07,27.05 28.07,25.02 26.54,23.5 9.78,23.5
N$30  (via drill 0.38)
  Top 0.406: Q7.1 v26.67,31.12
  Bottom 0.406: v26.67,31.12 U$7.5
N$31
  Top 0.406: R16.2 20.96,33.02 21.59,33.66 LED6.A
N$32
  Top 0.305: LED14.A 103.5,37.15 102.24,38.42 R2.2
N$33
  Top 0.254: 66.67,112.4 67.94,112.4 | 67.94,112.4 68.07,112.4 | 68.07,112.4 69.22,112.4 | 70.49,112.4 69.22,112.4 | 69.22,112.4 69.22,112.9 | 69.22,112.9 68.07,112.4 | 68.07,112.4 69.22,111.89 69.22,112.4 | 69.22,112.9 67.94,112.4 | 67.94,112.4 67.94,113.03 | 67.94,112.4 67.94,111.89 68.33,111.89
N$34
  Top 0.254: 73.41,99.69 74.8,99.69
N$35
  Bottom 0.406: R8.2 106.2,83.99 VADER-5V-EXT.4
N$36
  Top 0.406: DOOKU-12V-CRIT.5 DOOKU-12V-CRIT.6
  Top 1.27: DOOKU-12V-CRIT.6 130.18,58.42 | 130.18,58.42 130.18,59.05 L1.4 L1.3 L1.2 L1.1 | C21.+ 130.18,56.52 130.18,58.42
N$37
  Top 0.254: 73.66,80.65 75.06,80.65
N$38
  Top 0.254: 73.66,61.59 75.06,61.59
N$39
  Top 0.406: R9.2 20.96,16.51 21.59,17.14 LED1.A
N$40  (via drill 0.38, 0.6)
  Bottom 0.406: v30.35,12.57 25.53,12.57 | 25.53,12.57 23.5,12.57 22.86,13.21 U$6.8 22.16,14.54 C16.2 | U$6.6 25.4,12.7 25.53,12.57
  other vias: 43.31,14.35
  pour Top (rank 3, no thermals): 29.84,18.41 41.02,18.41 44.83,14.61 44.83,10.03 40.77,5.97 29.84,5.97
N$41
  pour Top (no thermals): 8.26,8.51 8.26,10.54 9.78,12.07 26.54,12.07 28.07,10.54 28.07,8.51 26.54,6.99 9.78,6.99
N$42  (via drill 0.38)
  Top 0.406: Q6.1 v26.67,14.61
  Bottom 0.406: U$6.5 v26.67,14.61
N$43
  Top 0.254: 75.06,42.55 73.53,42.55
N$44  (via drill 0.38)
  Bottom 0.406: v30.35,45.59 25.4,45.59 | 25.4,45.59 23.5,45.59 22.86,46.23 U$8.8 22.16,47.56 C26.2 | U$8.6 25.4,45.59
  pour Top (rank 3, no thermals): 29.84,51.18 41.02,51.18 44.83,47.37 44.83,42.8 40.77,38.73 29.84,38.73
N$45
  pour Top (no thermals): 8.26,41.53 8.26,43.56 9.78,45.09 26.54,45.09 28.07,43.56 28.07,41.53 26.54,40.01 9.78,40.01
N$46
  Top 0.406: LED2.A R10.2
N$47  (via drill 0.38)
  Top 0.406: Q9.1 v26.67,47.62
  Bottom 0.406: U$8.5 v26.67,47.62
N$48
  Top 0.813: R11.2 138.56,72.03 LED3.A
N$49
  Top 0.406: R18.2 20.96,49.53 21.59,50.16 LED7.A
N$50
  Top 0.406: LED4.A 133.28,137.56 133.35,137.32 R12.2
N$51  (via drill 0.6)  (1 unrouted)
  other vias: 32.39,114.94 32.39,113.66
N$52
  Top 0.406: R13.2 LED5.A
N$53  (via drill 0.6)
  other vias: 33.66,114.94
N$54  (via drill 0.38)
  Bottom 0.406: v30.35,62.1 25.4,62.1 | 25.4,62.1 23.5,62.1 22.86,62.74 U$9.8 22.16,64.08 C28.2 | U$9.6 25.4,62.1
  pour Top (rank 3, no thermals): 29.84,67.69 41.02,67.69 44.83,63.88 44.83,59.31 40.77,55.24 29.84,55.24
N$55
  pour Top (no thermals): 8.26,58.04 8.26,60.07 9.78,61.59 26.54,61.59 28.07,60.07 28.07,58.04 26.54,56.52 9.78,56.52
N$56  (via drill 0.38)
  Top 0.406: Q11.1 v26.67,64.13
  Bottom 0.406: U$9.5 v26.67,64.13
N$57
  Top 0.406: R20.2 20.96,66.04 21.59,66.67 LED8.A
N$58  (via drill 0.6)
  other vias: 34.92,114.94
N$59  (via drill 0.6)
  other vias: 36.2,114.94
N$60  (via drill 0.38)
  Bottom 0.406: v30.35,78.61 25.53,78.61 | 25.53,78.61 23.5,78.61 22.86,79.25 U$10.8 22.16,80.59 C30.2 | U$10.6 25.4,78.74 25.53,78.61
  pour Top (rank 3, no thermals): 29.84,84.2 41.02,84.2 44.83,80.39 44.83,75.82 40.77,71.75 29.84,71.75
N$61
  pour Top (no thermals): 8.26,74.55 8.26,76.58 9.78,78.1 26.54,78.1 28.07,76.58 28.07,74.55 26.54,73.03 9.78,73.03
N$62  (via drill 0.38)
  Top 0.406: Q14.1 v26.67,80.65
  Bottom 0.406: U$10.5 v26.67,80.65
N$63
  Top 0.406: R22.2 20.96,82.55 21.59,83.19 LED9.A
N$64  (via drill 0.6)  (1 unrouted)
  other vias: 32.39,98.43 32.39,97.16
N$65  (via drill 0.6)
  other vias: 38.73,114.94
N$66  (via drill 0.38)
  Bottom 0.406: v30.35,95.12 25.27,95.12 | 25.27,95.12 23.5,95.12 22.86,95.76 U$11.8 22.16,97.09 C32.2 | U$11.6 25.4,95.25 25.27,95.12
  pour Top (rank 3, no thermals): 29.84,100.71 41.12,100.71 44.83,96.93 44.83,92.33 40.77,88.26 29.84,88.26
N$67
  pour Top (no thermals): 8.26,91.06 8.26,93.09 9.78,94.62 26.54,94.62 28.07,93.09 28.07,91.06 26.54,89.53 9.78,89.53
N$68  (via drill 0.38)
  Top 0.406: Q16.1 v26.67,97.16
  Bottom 0.406: U$11.5 v26.67,97.16
N$69
  Top 0.406: R24.2 20.96,99.06 21.59,99.69 LED10.A
N$70  (via drill 0.6)
  other vias: 37.47,113.66
N$71  (via drill 0.6)
  other vias: 37.47,112.4
N$72
  Top 0.406: Q18.2 19.05,126.37 19.05,128.02 | 19.05,128.02 C34.2 | U$12.8 17.27,127.76 | 17.27,127.76 17.27,128.91 16.89,129.29 15.11,129.29 14.73,128.91 U$12.6 | 17.27,127.76 18.79,127.76 19.05,128.02
  Top 1.27: Q1.4 27.93,126.43 Q18.4 Q18.2
N$73
  Top 1.27: Q18.3 17.26,124.06 R26.1 10.14,123.96 ARM_P.R
N$74
  Top 0.406: U$12.5 13.46,129.54 13.97,130.05 21.21,130.05 21.59,129.67 21.59,128.74 Q18.1
N$75
  Top 0.406: LED11.A 14.1,121.16 R26.2
N$76  (via drill 0.6)
  other vias: 37.47,109.85
N$77  (via drill 0.6)
  other vias: 37.47,111.12
N$78  (via drill 0.38)
  Bottom 0.406: v30.35,111.63 25.53,111.63 | 25.53,111.63 23.5,111.63 22.86,112.27 U$13.8 22.16,113.6 C36.2 | U$13.6 25.4,111.76 25.53,111.63
  pour Top (rank 3, no thermals): 29.84,117.22 41.02,117.22 44.83,113.41 44.83,108.84 40.77,104.78 29.84,104.78
N$79
  pour Top (no thermals): 8.26,107.57 8.26,109.6 9.78,111.12 26.54,111.12 28.07,109.6 28.07,107.57 26.54,106.04 9.78,106.04
N$80  (via drill 0.38)
  Top 0.406: Q20.1 v26.67,113.66
  Bottom 0.406: U$13.5 v26.67,113.66
N$81
  Top 0.406: R28.2 20.96,115.57 21.59,116.21 LED12.A
N$82  (via drill 0.6)
  other vias: 37.47,108.59
N$83  (via drill 0.6)
  other vias: 36.2,113.66
N$84  (via drill 0.6)
  other vias: 36.2,112.4
N$85  (via drill 0.6)
  other vias: 36.2,111.12
N$86  (via drill 0.6)
  other vias: 36.2,109.85
N$87  (via drill 0.6)
  other vias: 36.2,108.59
N$88  (via drill 0.6)
  other vias: 36.2,107.31
N$89  (via drill 0.6)
  other vias: 33.66,108.59
N$90  (via drill 0.6)
  other vias: 34.92,108.59
N$91  (via drill 0.6)
  other vias: 34.92,109.85
N$92  (via drill 0.6)
  other vias: 34.92,111.12
N$93  (via drill 0.6)
  other vias: 33.66,112.4
N$94  (via drill 0.6)
  other vias: 34.92,112.4
N$95  (via drill 0.6)
  other vias: 34.92,113.66
N$96  (via drill 0.6)
  other vias: 33.66,113.66
N$97  (via drill 0.6)
  other vias: 32.39,113.66
N$98  (via drill 0.6)
  other vias: 32.39,112.4
N$99  (via drill 0.6)
  other vias: 32.39,111.12
N$100
  Top 0.406: L3.1 128.04,24.49 C17.1
  Top 1.016: OKI-78SR-5/1.5-W36H.3 L3.1
N$101  (via drill 0.6)
  other vias: 33.66,111.12
N$102  (via drill 0.6)
  other vias: 33.66,109.85
N$103  (via drill 0.6)
  other vias: 32.39,109.85
N$104  (via drill 0.6)
  other vias: 32.39,108.59
N$105  (via drill 0.6)
  other vias: 32.39,107.31
N$106  (via drill 0.6)
  other vias: 33.66,107.31
N$107  (via drill 0.6)
  other vias: 34.92,107.31
N$108  (via drill 0.6)
  other vias: 33.66,98.43
N$109  (via drill 0.6)
  other vias: 38.73,113.66
N$110  (via drill 0.6)
  other vias: 38.73,112.4
N$111  (via drill 0.6)
  other vias: 38.73,111.12
N$112  (via drill 0.6)
  other vias: 38.73,109.85
N$113  (via drill 0.6)
  other vias: 38.73,108.59
N$114
  Top 0.305: R15.1 111.25,106.04 111.25,107.34 Q12.1
N$115  (via drill 0.6)
  other vias: 38.73,107.31
N$116  (via drill 0.6)
  other vias: 34.92,98.43
N$117  (via drill 0.6)
  other vias: 36.2,98.43
N$118  (via drill 0.6)
  other vias: 38.73,98.43
N$119  (via drill 0.6)
  other vias: 37.47,97.16
N$120  (via drill 0.6)
  other vias: 37.47,95.88
N$121  (via drill 0.6)
  other vias: 37.47,93.34
N$122  (via drill 0.6)
  other vias: 37.47,94.62
N$123  (via drill 0.6)
  other vias: 37.47,92.07
N$124  (via drill 0.6)
  other vias: 36.2,97.16
N$125  (via drill 0.6)
  other vias: 36.2,95.88
N$126  (via drill 0.6)
  other vias: 36.2,94.62
N$127  (via drill 0.6)
  other vias: 36.2,93.34
N$128  (via drill 0.6)
  other vias: 36.2,92.07
N$129  (via drill 0.6)
  other vias: 36.2,90.81
N$130  (via drill 0.6)
  other vias: 33.66,92.07
N$131  (via drill 0.6)
  other vias: 34.92,92.07
N$132  (via drill 0.6)
  other vias: 34.92,93.34
N$133  (via drill 0.6)
  other vias: 34.92,94.62
N$134  (via drill 0.6)
  other vias: 33.66,95.88
N$135  (via drill 0.6)
  other vias: 34.92,95.88
N$136  (via drill 0.6)
  other vias: 34.92,97.16
N$137  (via drill 0.6)
  other vias: 33.66,97.16
N$138  (via drill 0.6)
  other vias: 32.39,97.16
N$139  (via drill 0.6)
  other vias: 32.39,95.88
N$140  (via drill 0.6)
  other vias: 32.39,94.62
N$141  (via drill 0.6)
  other vias: 33.66,94.62
N$142  (via drill 0.6)
  other vias: 33.66,93.34
N$143  (via drill 0.6)
  other vias: 32.39,93.34
N$144  (via drill 0.6)
  other vias: 32.39,92.07
N$145  (via drill 0.6)
  other vias: 32.39,90.81
N$146  (via drill 0.6)
  other vias: 33.66,90.81
N$147  (via drill 0.6)
  other vias: 34.92,90.81
N$148  (via drill 0.6)
  other vias: 38.73,97.16
N$149  (via drill 0.6)
  other vias: 38.73,95.88
N$150  (via drill 0.6)
  other vias: 38.73,94.62
N$151  (via drill 0.6)
  other vias: 38.73,93.34
N$152  (via drill 0.6)
  other vias: 38.73,92.07
N$153  (via drill 0.6)
  other vias: 38.73,90.81
N$154  (via drill 0.6)  (1 unrouted)
  other vias: 32.39,81.91 32.39,80.65
N$155  (via drill 0.6)
  other vias: 33.66,81.91
N$156  (via drill 0.6)
  other vias: 34.92,81.91
N$157  (via drill 0.6)
  other vias: 36.2,81.91
N$158  (via drill 0.6)
  other vias: 38.73,81.91
N$159  (via drill 0.6)
  other vias: 37.47,80.65
N$160  (via drill 0.6)
  other vias: 37.47,79.38
N$161  (via drill 0.6)
  other vias: 37.47,76.84
N$162  (via drill 0.6)
  other vias: 37.47,78.1
N$163  (via drill 0.6)
  other vias: 37.47,75.56
N$164  (via drill 0.6)
  other vias: 36.2,80.65
N$165  (via drill 0.6)
  other vias: 36.2,79.38
N$166  (via drill 0.6)
  other vias: 36.2,78.1
N$167  (via drill 0.6)
  other vias: 36.2,76.84
N$168  (via drill 0.6)
  other vias: 36.2,75.56
N$169  (via drill 0.6)
  other vias: 36.2,74.29
N$170  (via drill 0.6)
  other vias: 33.66,75.56
N$171  (via drill 0.6)
  other vias: 34.92,75.56
N$172  (via drill 0.6)
  other vias: 34.92,76.84
N$173  (via drill 0.6)
  other vias: 34.92,78.1
N$174  (via drill 0.6)
  other vias: 33.66,79.38
N$175  (via drill 0.6)
  other vias: 34.92,79.38
N$176  (via drill 0.6)
  other vias: 34.92,80.65
N$177  (via drill 0.6)
  other vias: 33.66,80.65
N$178  (via drill 0.6)
  other vias: 32.39,80.65
N$179  (via drill 0.6)
  other vias: 32.39,79.38
N$180  (via drill 0.6)
  other vias: 32.39,78.1
N$181  (via drill 0.6)
  other vias: 33.66,78.1
N$182  (via drill 0.6)
  other vias: 33.66,76.84
N$183  (via drill 0.6)
  other vias: 32.39,76.84
N$184  (via drill 0.6)
  other vias: 32.39,75.56
N$185  (via drill 0.6)
  other vias: 32.39,74.29
N$186  (via drill 0.6)
  other vias: 33.66,74.29
N$187  (via drill 0.6)
  other vias: 34.92,74.29
N$188  (via drill 0.6)
  other vias: 38.73,80.65
N$189  (via drill 0.6)
  other vias: 38.73,79.38
N$190  (via drill 0.6)
  other vias: 38.73,78.1
N$191  (via drill 0.6)
  other vias: 38.73,76.84
N$192  (via drill 0.6)
  other vias: 38.73,75.56
N$193  (via drill 0.6)
  other vias: 38.73,74.29
N$194  (via drill 0.6)  (1 unrouted)
  other vias: 32.39,65.41 32.39,64.13
N$195  (via drill 0.6)
  other vias: 33.66,65.41
N$196  (via drill 0.6)
  other vias: 34.92,65.41
N$197  (via drill 0.6)
  other vias: 36.2,65.41
N$198  (via drill 0.6)
  other vias: 38.73,65.41
N$199  (via drill 0.6)
  other vias: 37.47,64.13
N$200  (via drill 0.6)
  other vias: 37.47,62.87
N$201  (via drill 0.6)
  other vias: 37.47,60.33
N$202  (via drill 0.6)
  other vias: 37.47,61.59
N$203  (via drill 0.6)
  other vias: 37.47,59.05
N$204  (via drill 0.6)
  other vias: 36.2,64.13
N$205  (via drill 0.6)
  other vias: 36.2,62.87
N$206  (via drill 0.6)
  other vias: 36.2,61.59
N$207  (via drill 0.6)
  other vias: 36.2,60.33
N$208  (via drill 0.6)
  other vias: 36.2,59.05
N$209  (via drill 0.6)
  other vias: 36.2,57.79
N$210  (via drill 0.6)
  other vias: 33.66,59.05
N$211  (via drill 0.6)
  other vias: 34.92,59.05
N$212  (via drill 0.6)
  other vias: 34.92,60.33
N$213  (via drill 0.6)
  other vias: 34.92,61.59
N$214  (via drill 0.6)
  other vias: 33.66,62.87
N$215  (via drill 0.6)
  other vias: 34.92,62.87
N$216  (via drill 0.6)
  other vias: 34.92,64.13
N$217  (via drill 0.6)
  other vias: 33.66,64.13
N$218  (via drill 0.6)
  other vias: 32.39,64.13
N$219  (via drill 0.6)
  other vias: 32.39,62.87
N$220  (via drill 0.6)
  other vias: 32.39,61.59
N$221  (via drill 0.6)
  other vias: 33.66,61.59
N$222  (via drill 0.6)
  other vias: 33.66,60.33
N$223  (via drill 0.6)
  other vias: 32.39,60.33
N$224  (via drill 0.6)
  other vias: 32.39,59.05
N$225  (via drill 0.6)
  other vias: 32.39,57.79
N$226  (via drill 0.6)
  other vias: 33.66,57.79
N$227  (via drill 0.6)
  other vias: 34.92,57.79
N$228  (via drill 0.6)
  other vias: 38.73,64.13
N$229  (via drill 0.6)
  other vias: 38.73,62.87
N$230  (via drill 0.6)
  other vias: 38.73,61.59
N$231  (via drill 0.6)
  other vias: 38.73,60.33
N$232  (via drill 0.6)
  other vias: 38.73,59.05
N$233  (via drill 0.6)
  other vias: 38.73,57.79
N$234  (via drill 0.6)  (1 unrouted)
  other vias: 32.39,48.9 32.39,47.62
N$235  (via drill 0.6)
  other vias: 33.66,48.9
N$236  (via drill 0.6)
  other vias: 34.92,48.9
N$237  (via drill 0.6)
  other vias: 36.2,48.9
N$238  (via drill 0.6)
  other vias: 38.73,48.9
N$239  (via drill 0.6)
  other vias: 37.47,47.62
N$240  (via drill 0.6)
  other vias: 37.47,46.35
N$241  (via drill 0.6)
  other vias: 37.47,43.81
N$242  (via drill 0.6)
  other vias: 37.47,45.09
N$243  (via drill 0.6)
  other vias: 37.47,42.55
N$244  (via drill 0.6)
  other vias: 36.2,47.62
N$245  (via drill 0.6)
  other vias: 36.2,46.35
N$246  (via drill 0.6)
  other vias: 36.2,45.09
N$247  (via drill 0.6)
  other vias: 36.2,43.81
N$248  (via drill 0.6)
  other vias: 36.2,42.55
N$249  (via drill 0.6)
  other vias: 36.2,41.27
N$250  (via drill 0.6)
  other vias: 33.66,42.55
N$251  (via drill 0.6)
  other vias: 34.92,42.55
N$252  (via drill 0.6)
  other vias: 34.92,43.81
N$253  (via drill 0.6)
  other vias: 34.92,45.09
N$254  (via drill 0.6)
  other vias: 33.66,46.35
N$255  (via drill 0.6)
  other vias: 34.92,46.35
N$256  (via drill 0.6)
  other vias: 34.92,47.62
N$257  (via drill 0.6)
  other vias: 33.66,47.62
N$258  (via drill 0.6)
  other vias: 32.39,47.62
N$259  (via drill 0.6)
  other vias: 32.39,46.35
N$260  (via drill 0.6)
  other vias: 32.39,45.09
N$261  (via drill 0.6)
  other vias: 33.66,45.09
N$262  (via drill 0.6)
  other vias: 33.66,43.81
N$263  (via drill 0.6)
  other vias: 32.39,43.81
N$264  (via drill 0.6)
  other vias: 32.39,42.55
N$265  (via drill 0.6)
  other vias: 32.39,41.27
N$266  (via drill 0.6)
  other vias: 33.66,41.27
N$267  (via drill 0.6)
  other vias: 34.92,41.27
N$268  (via drill 0.6)
  other vias: 38.73,47.62
N$269  (via drill 0.6)
  other vias: 38.73,46.35
N$270  (via drill 0.6)
  other vias: 38.73,45.09
N$271  (via drill 0.6)
  other vias: 38.73,43.81
N$272  (via drill 0.6)
  other vias: 38.73,42.55
N$273  (via drill 0.6)
  other vias: 38.73,41.27
N$274  (via drill 0.6)  (1 unrouted)
  other vias: 32.39,32.39 32.39,31.12
N$275  (via drill 0.6)
  other vias: 33.66,32.39
N$276  (via drill 0.6)
  other vias: 34.92,32.39
N$277  (via drill 0.6)
  other vias: 36.2,32.39
N$278  (via drill 0.6)
  other vias: 38.73,32.39
N$279  (via drill 0.6)
  other vias: 37.47,31.12
N$280  (via drill 0.6)
  other vias: 37.47,29.84
N$281  (via drill 0.6)
  other vias: 37.47,27.3
N$282  (via drill 0.6)
  other vias: 37.47,28.57
N$283  (via drill 0.6)
  other vias: 37.47,26.04
N$284  (via drill 0.6)
  other vias: 36.2,31.12
N$285  (via drill 0.6)
  other vias: 36.2,29.84
N$286  (via drill 0.6)
  other vias: 36.2,28.57
N$287  (via drill 0.6)
  other vias: 36.2,27.3
N$288  (via drill 0.6)
  other vias: 36.2,26.04
N$289  (via drill 0.6)
  other vias: 36.2,24.77
N$290  (via drill 0.6)
  other vias: 33.66,26.04
N$291  (via drill 0.6)
  other vias: 34.92,26.04
N$292  (via drill 0.6)
  other vias: 34.92,27.3
N$293  (via drill 0.6)
  other vias: 34.92,28.57
N$294  (via drill 0.6)
  other vias: 33.66,29.84
N$295  (via drill 0.6)
  other vias: 34.92,29.84
N$296  (via drill 0.6)
  other vias: 34.92,31.12
N$297  (via drill 0.6)
  other vias: 33.66,31.12
N$298  (via drill 0.6)
  other vias: 32.39,31.12
N$299  (via drill 0.6)
  other vias: 32.39,29.84
N$300  (via drill 0.6)
  other vias: 32.39,28.57
N$301  (via drill 0.6)
  other vias: 33.66,28.57
N$302  (via drill 0.6)
  other vias: 33.66,27.3
N$303  (via drill 0.6)
  other vias: 32.39,27.3
N$304  (via drill 0.6)
  other vias: 32.39,26.04
N$305  (via drill 0.6)
  other vias: 32.39,24.77
N$306  (via drill 0.6)
  other vias: 33.66,24.77
N$307  (via drill 0.6)
  other vias: 34.92,24.77
N$308  (via drill 0.6)
  other vias: 38.73,31.12
N$309  (via drill 0.6)
  other vias: 38.73,29.84
N$310  (via drill 0.6)
  other vias: 38.73,28.57
N$311  (via drill 0.6)
  other vias: 38.73,27.3
N$312  (via drill 0.6)
  other vias: 38.73,26.04
N$313  (via drill 0.6)
  other vias: 38.73,24.77
N$314  (via drill 0.6)  (1 unrouted)
  other vias: 32.39,15.88 32.39,14.61
N$315  (via drill 0.6)
  other vias: 33.66,15.88
N$316  (via drill 0.6)
  other vias: 34.92,15.88
N$317  (via drill 0.6)
  other vias: 36.2,15.88
N$318  (via drill 0.6)
  other vias: 38.73,15.88
N$319  (via drill 0.6)
  other vias: 37.47,14.61
N$320  (via drill 0.6)
  other vias: 37.47,13.34
N$321  (via drill 0.6)
  other vias: 37.47,10.79
N$322  (via drill 0.6)
  other vias: 37.47,12.07
N$323  (via drill 0.6)
  other vias: 37.47,9.53
N$324  (via drill 0.6)
  other vias: 36.2,14.61
N$325  (via drill 0.6)
  other vias: 36.2,13.34
N$326  (via drill 0.6)
  other vias: 36.2,12.07
N$327  (via drill 0.6)
  other vias: 36.2,10.79
N$328  (via drill 0.6)
  other vias: 36.2,9.53
N$329  (via drill 0.6)
  other vias: 36.2,8.26
N$330  (via drill 0.6)
  other vias: 33.66,9.53
N$331  (via drill 0.6)
  other vias: 34.92,9.53
N$332  (via drill 0.6)
  other vias: 34.92,10.79
N$333  (via drill 0.6)
  other vias: 34.92,12.07
N$334  (via drill 0.6)
  other vias: 33.66,13.34
N$335  (via drill 0.6)
  other vias: 34.92,13.34
N$336  (via drill 0.6)
  other vias: 34.92,14.61
N$337  (via drill 0.6)
  other vias: 33.66,14.61
N$338  (via drill 0.6)
  other vias: 32.39,14.61
N$339  (via drill 0.6)
  other vias: 32.39,13.34
N$340  (via drill 0.6)
  other vias: 32.39,12.07
N$341  (via drill 0.6)
  other vias: 33.66,12.07
N$342  (via drill 0.6)
  other vias: 33.66,10.79
N$343  (via drill 0.6)
  other vias: 32.39,10.79
N$344  (via drill 0.6)
  other vias: 32.39,9.53
N$345  (via drill 0.6)
  other vias: 32.39,8.26
N$346  (via drill 0.6)
  other vias: 33.66,8.26
N$347  (via drill 0.6)
  other vias: 34.92,8.26
N$348  (via drill 0.6)
  other vias: 38.73,14.61
N$349  (via drill 0.6)
  other vias: 38.73,13.34
N$350  (via drill 0.6)
  other vias: 38.73,12.07
N$351  (via drill 0.6)
  other vias: 38.73,10.79
N$352  (via drill 0.6)
  other vias: 38.73,9.53
N$353  (via drill 0.6)
  other vias: 38.73,8.26
PRIMARY-VMEAS
  Top 0.406: R3.1 R4.2 89.53,36.55 89.53,36.07 U$1.19
RXD
  Top 0.305: U$3.RO 117.22,44.45 117.86,45.09 117.86,48.13 117.47,48.77 U$1.4
V_BATT
  Top 1.27: Q1.1 48.84,126.43 51.44,123.82
  pour Top (rank 2, no thermals): 45.09,114.94 45.09,108.59 50.16,108.59 50.16,98.43 45.09,98.43 45.09,92.07 50.16,92.07 50.16,81.91 45.09,81.91 45.09,75.56 50.16,75.56 50.16,65.41 45.09,65.41 45.09,59.05 50.16,59.05 50.16,48.9 45.09,48.9 45.09,42.55 50.16,42.55 50.16,32.39 45.4,32.39 45.4,26.04 50.16,26.04 50.16,15.88 45.09,15.88 45.09,9.53 50.16,9.53 55.34,2.41 85.72,2.38 85.72,106.04 86.36,107.31 86.36,125.09 50.16,125.09 50.16,114.94

## Text on the board
tStop: Jake Armenta / Missouri MRDT / Powerboard 2015